# Altium project Christmas Keychain.PrjPcb
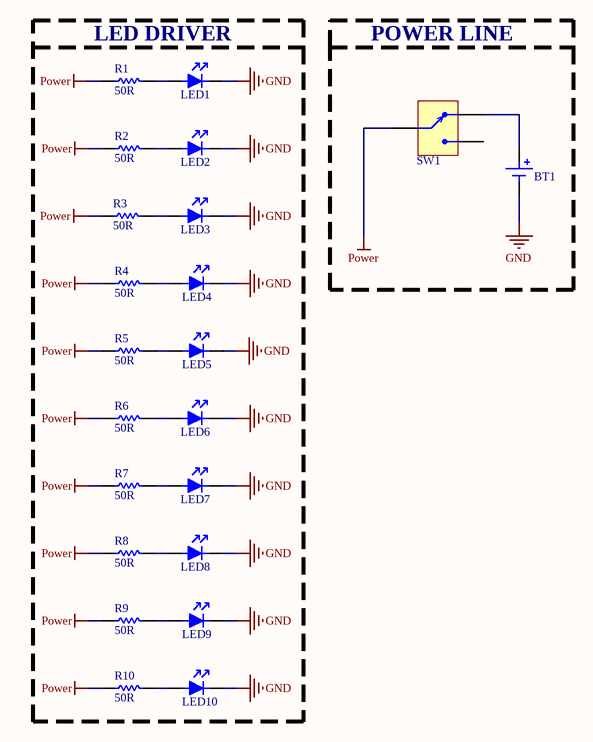
[diagram p0: Christmas Keychain.SchDoc]
1 sheet, 22 parts. Net scope: global (net labels, ports and power ports of the same name join across sheets).
Board file: Christmas Keychain.PcbDoc

## Sheet Christmas Keychain.SchDoc
size A3; SheetNumber: 1; SheetTotal: 1

### Parts
BT1  BS-7  [BATTERY HOLDER]  (value not drawn)
LED1  151031SS06000  [RED LED]  (value not drawn)
LED2  151031SS06000  [RED LED]  (value not drawn)
LED3  151031SS06000  [RED LED]  (value not drawn)
LED4  151031SS06000  [RED LED]  (value not drawn)
LED5  151031SS06000  [RED LED]  (value not drawn)
LED6  151031SS06000  [RED LED]  (value not drawn)
LED7  151031SS06000  [RED LED]  (value not drawn)
LED8  151031SS06000  [RED LED]  (value not drawn)
LED9  151031SS06000  [RED LED]  (value not drawn)
LED10  151031SS06000  [RED LED]  (value not drawn)
R1  value 50R  [RES 0805]  (hidden comment: CRCW080550R0FKTA)
R2  value 50R  [RES 0805]  (hidden comment: CRCW080550R0FKTA)
R3  value 50R  [RES 0805]  (hidden comment: CRCW080550R0FKTA)
R4  value 50R  [RES 0805]  (hidden comment: CRCW080550R0FKTA)
R5  value 50R  [RES 0805]  (hidden comment: CRCW080550R0FKTA)
R6  value 50R  [RES 0805]  (hidden comment: CRCW080550R0FKTA)
R7  value 50R  [RES 0805]  (hidden comment: CRCW080550R0FKTA)
R8  value 50R  [RES 0805]  (hidden comment: CRCW080550R0FKTA)
R9  value 50R  [RES 0805]  (hidden comment: CRCW080550R0FKTA)
R10  value 50R  [RES 0805]  (hidden comment: CRCW080550R0FKTA)
SW1  450404015514  [SLIDE SWITCH]  (value not drawn)

### Blocks framed on the sheet
POWER LINE: BT1 SW1

### Nets
GND: BT1.2 LED1.2 LED2.2 LED3.2 LED4.2 LED5.2 LED6.2 LED7.2 LED8.2 LED9.2 LED10.2
Power: R1.1 R2.1 R3.1 R4.1 R5.1 R6.1 R7.1 R8.1 R9.1 R10.1 SW1.2
NetBT1_1: BT1.1 SW1.1
NetLED1_1: LED1.1 R1.2
NetLED2_1: LED2.1 R2.2
NetLED3_1: LED3.1 R3.2
NetLED4_1: LED4.1 R4.2
NetLED5_1: LED5.1 R5.2
NetLED6_1: LED6.1 R6.2
NetLED7_1: LED7.1 R7.2
NetLED8_1: LED8.1 R8.2
NetLED9_1: LED9.1 R9.2
NetLED10_1: LED10.1 R10.2

Not connected (* = marked no-connect by the designer): SW1 3

### Notes on the sheet
- LED DRIVER
- Dosya Adı / File Name
- Hazırlayan / Prepared By
- Tanım / Description
- Değiştirme Tarihi / Changed Date
- Bölüm / Department
- Onaylayan / Approved By
- Kontrol Eden / Checked By
- Boyut / Size
- Sayfa / Sheet
- Revizyon / Revision

### Library data of the parts
BT1 = BATTERY HOLDER TH: BATTERY HOLDER 20MM TH; Manufacturer: Wurth Electronics; Manufacturer Part Number: 150060BS75000; Lens Color: Colorless; Luminous Intensity: 145mcd; Forward Current: 30mA; Forward Voltage: 3.2V; Wavelength: 470nm; Viewing Angle: 140°; Lens Style: Clear,Flat,Rectangular; Test Current: 20mA; Lens Transparency: Clear; Max Reverse Voltage (DC): 5V; Power Dissipation: 105mW; Lens Size: 0.7mm; ComponentLink1URL: https://datasheet.ciiva.com/29563/150060bs75000-29563034.pdf?src-supplier=Digikey; ComponentLink1Description: https://datasheet.ciiva.com/29563/150060bs75000-29563034.pdf?src-supplier=Digikey; ComponentLink2URL: https://datasheet.ciiva.com/29279/759426-da-01-en-chipled-0603-w-kl-blau-150060bs75000-29279193.pdf?src-supplier=Conrad; ComponentLink2Description: https://datasheet.ciiva.com/29279/759426-da-01-en-chipled-0603-w-kl-blau-150060bs75000-29279193.pdf?src-supplier=Conrad; ComponentLink3URL: https://datasheet.ciiva.com/22656/1911343-22656939.pdf?src-supplier=Element14; ComponentLink3Description: https://datasheet.ciiva.com/22656/1911343-22656939.pdf?src-supplier=Element14; ComponentLink4URL: https://datasheet.ciiva.com/48430/150060bs75000-eng-tds-48430039.pdf?src-supplier=Distrelec; ComponentLink4Description: https://datasheet.ciiva.com/48430/150060bs75000-eng-tds-48430039.pdf?src-supplier=Distrelec; ComponentLink5URL: https://datasheet.ciiva.com/29563/150060bs75000-29563035.pdf?src-supplier=Digikey; ComponentLink5Description: https://datasheet.ciiva.com/29563/150060bs75000-29563035.pdf?src-supplier=Digikey; ComponentLink6URL: https://datasheet.ciiva.com/29563/150060bs75000-29563036.pdf?src-supplier=Digikey; ComponentLink6Description: https://datasheet.ciiva.com/29563/150060bs75000-29563036.pdf?src-supplier=Digikey; Supplier: Digikey; Supplier Part Number: 732-4966-1-ND; RoHS: Yes; Category: LEDs; Stock: 35055; Pricing: 1=0,16, 50=0,155, 100=0,133, 500=0,115 (USD); Mounting Technology: Surface Mount; Case/Package: 0603; Color: Blue; Case Code (Metric): 1608; Case Code (Imperial): 0603; Min Operating Temperature: -40°C; Max Operating Temperature: 85°C; Package Quantity: 1; Packaging: Cut Tape; Dominant Wavelength: 470nm; Series: WL-SMCW; Reverse Voltage: 5V; Length: 1.6mm; Width: 0.8mm; Height: 0.8mm; RoHS Compliant: Yes; Reach SVHC Compliant: Unknown
LED1-LED10 = RED LED TH: LED RED 3MM ROUND TH; Manufacturer: Wurth Electronics; Wavelength: 630nm; Luminous Intensity: 35mcd; Viewing Angle: 60°; Forward Voltage: 2.2V; Lens Style: Round,Domed,Circular; Dominant Wavelength: 640nm; Test Current: 20mA; Forward Current: 30mA; Lens Transparency: Diffused; Supplier: Digikey; Supplier Part Number: 732-5006-ND; Manufacturer Part Number: 151031SS06000; RoHS: Yes; Category: LEDs; Stock: 1598; Pricing: 1=0,18, 50=0,172, 100=0,147, 500=0,127 (USD); Mounting Technology: Through Hole; Case/Package: Radial; Color: Red; Lens Color: Red; Min Operating Temperature: -40°C; Max Operating Temperature: 85°C; Series: WL-TMRC; Height: 5.55mm; Lens Size: 3mm; RoHS Compliant: Yes; Reach SVHC Compliant: Unknown; ComponentLink1URL: https://datasheet.ciiva.com/22657/151031ss06000-22657010.pdf?src-supplier=Element14; ComponentLink1Description: https://datasheet.ciiva.com/22657/151031ss06000-22657010.pdf?src-supplier=Element14; ComponentLink2URL: https://datasheet.ciiva.com/29335/759483-da-01-en-tht-led-3mm-superrot-151031ss06000-29335440.pdf?src-supplier=Conrad; ComponentLink2Description: https://datasheet.ciiva.com/29335/759483-da-01-en-tht-led-3mm-superrot-151031ss06000-29335440.pdf?src-supplier=Conrad; ComponentLink3URL: https://datasheet.ciiva.com/29562/151031ss06000-29562907.pdf?src-supplier=Digikey; ComponentLink3Description: https://datasheet.ciiva.com/29562/151031ss06000-29562907.pdf?src-supplier=Digikey
R1-R10 = RES 50 OHM 0805 SMD: RES 50 OHM 1% 1/8W 0805; Manufacturer: KOA Speer; Manufacturer Part Number: RK73B2ATTD101J; Tolerance: 5%; Power Rating: 125mW; Voltage Rating: 150V; Temperature Coefficient: 200ppm/°C; Supplier Part Number: 2019-RK73B2ATTD101JDKR-ND; RoHS: Yes; Category: Chip SMD Resistors; Stock: 513996; Pricing: 1=0,1, 10=0,023, 50=0,0146, 100=0,0121, 500=0,0083, 1000=0,00717 (USD); Case/Package: 0805; Case Code (Imperial): 0805; Case Code (Metric): 2012; Min Operating Temperature: -55°C; Max Operating Temperature: 155°C; Packaging: Tape and Reel; Package Quantity: 5000; Resistor Type: Thick Film; Termination: SMD/SMT; Voltage Rating (DC): 150V; Series: RK73B; Construction: Rectangular; Technology: THICK FILM; Resistance Tolerance: 5%; Length: 2mm; Width: 1.25mm; Height: 0.5mm; Depth: 1.25mm; Military Standard: Not; Lead Free: Lead Free; RoHS Compliant: Yes; Reach SVHC Compliant: Unknown; ComponentLink1URL: https://datasheet.ciiva.com/5557/rk73b-5557130.pdf?src-supplier=Mouser; ComponentLink1Description: https://datasheet.ciiva.com/5557/rk73b-5557130.pdf?src-supplier=Mouser; Supplier: Digikey
SW1 = SLIDE SWITCH SMD: SLIDE SWITCH SMD 0.3A 5V; Manufacturer: Wurth Electronics; Current Rating: 300mA; Insulation Resistance: 100MR; Supplier: Digikey; Supplier Part Number: 732-13665-1-ND; Manufacturer Part Number: 450404015514; RoHS: No; Category: Uncategorized; Stock: 9705; Pricing: 1=0,79, 25=0,768, 50=0,733, 250=0,663, 1500=0,582 (USD); Packaging: 10Packaging; Voltage Rating: 5V; ComponentLink1URL: https://katalog.we-online.de/em/datasheet/450404015514.pdf?src-supplier=Digikey; ComponentLink1Description: https://katalog.we-online.de/em/datasheet/450404015514.pdf?src-supplier=Digikey